# Altium schematic sheet Gecko_IO.SchDoc: Gecko_IO
size A4; Organization: Gateway; Address1: University of Colorado; Address2: Boulder; DocumentNumber: 5; Revision: 1; SheetNumber: 5; SheetTotal: 6
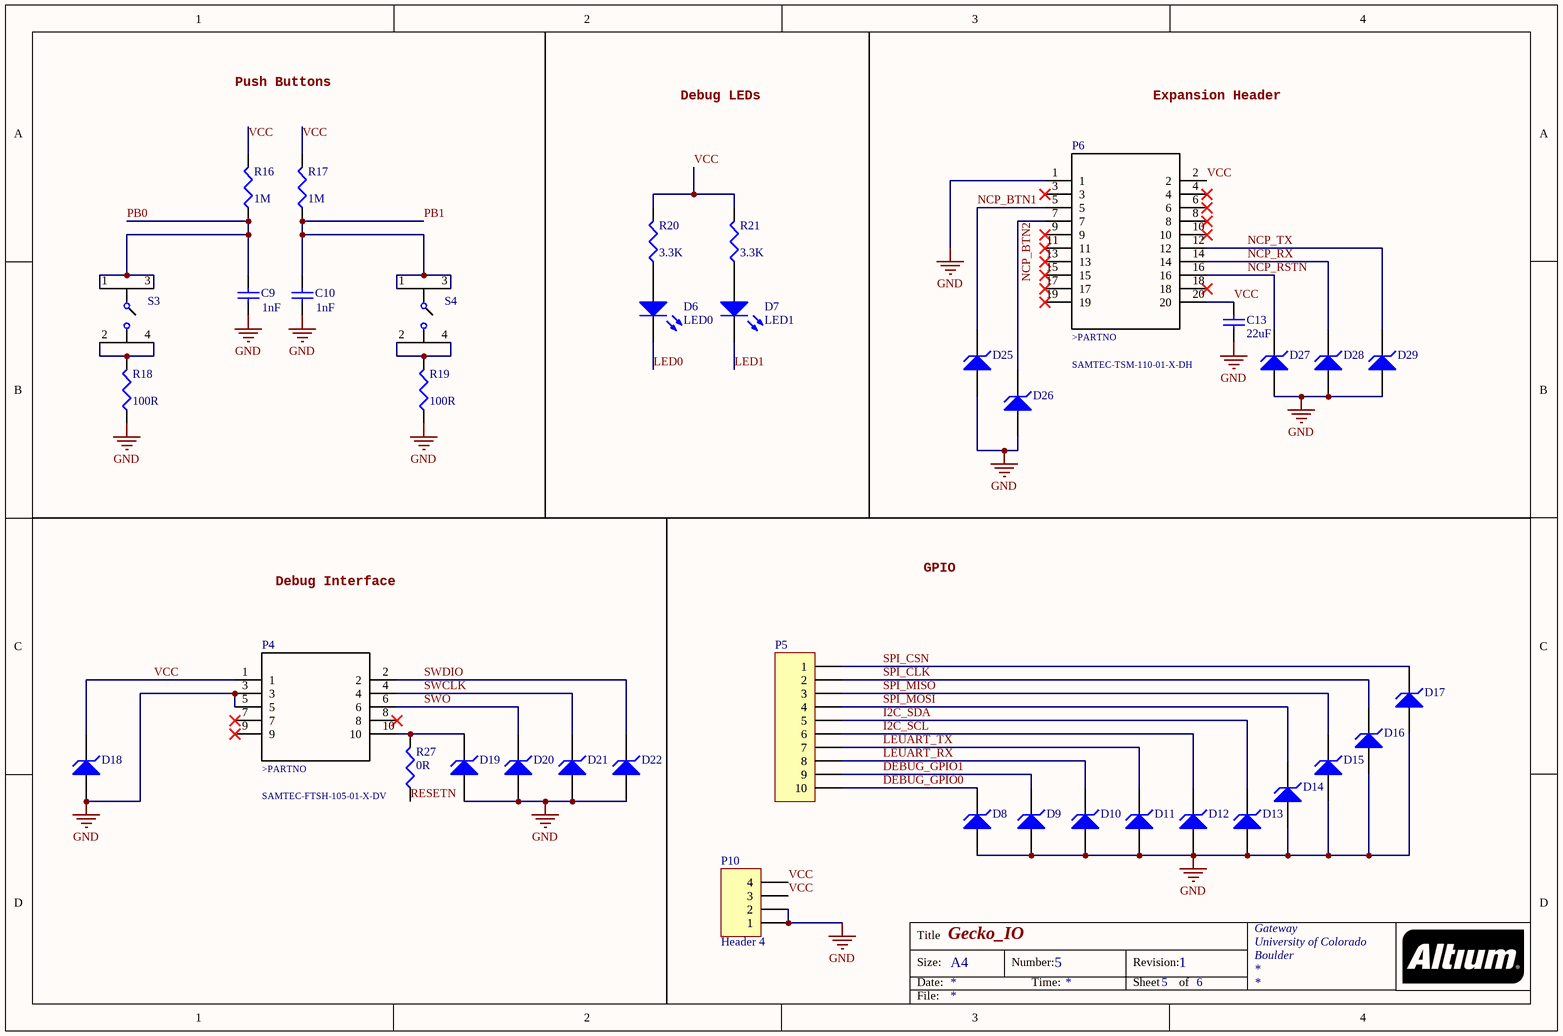
[diagram p0: Gecko_IO.SchDoc]

## Parts
C9  value 1nF  [1608[0603]]  (hidden comment: 06035C102JAT2A)
C10  value 1nF  [1608[0603]]  (hidden comment: 06035C102JAT2A)
C13  value 22uF  [1608[0603]]  (hidden comment: CL10A226MPCNUBE)
D6  LED0  [1608[0603]]
D7  LED1  [1608[0603]]
D8  CZRQR3V3B-HF  [0402]  (value not drawn)
D9  CZRQR3V3B-HF  [0402]  (value not drawn)
D10  CZRQR3V3B-HF  [0402]  (value not drawn)
D11  CZRQR3V3B-HF  [0402]  (value not drawn)
D12  CZRQR3V3B-HF  [0402]  (value not drawn)
D13  CZRQR3V3B-HF  [0402]  (value not drawn)
D14  CZRQR3V3B-HF  [0402]  (value not drawn)
D15  CZRQR3V3B-HF  [0402]  (value not drawn)
D16  CZRQR3V3B-HF  [0402]  (value not drawn)
D17  CZRQR3V3B-HF  [0402]  (value not drawn)
D18  CZRQR3V3B-HF  [0402]  (value not drawn)
D19  CZRQR3V3B-HF  [0402]  (value not drawn)
D20  CZRQR3V3B-HF  [0402]  (value not drawn)
D21  CZRQR3V3B-HF  [0402]  (value not drawn)
D22  CZRQR3V3B-HF  [0402]  (value not drawn)
D25  CZRQR3V3B-HF  [0402]  (value not drawn)
D26  CZRQR3V3B-HF  [0402]  (value not drawn)
D27  CZRQR3V3B-HF  [0402]  (value not drawn)
D28  CZRQR3V3B-HF  [0402]  (value not drawn)
D29  CZRQR3V3B-HF  [0402]  (value not drawn)
P4  PROG_HDR  [SAMTEC-FTSH-105-01-X-DV]  (value not drawn)
P5  (no value)  [HDR1X10]
P6  TSM-110-01-L-DH-A-P-TR  [SAMTEC-TSM-110-01-X-DH]  (value not drawn)
P10  Header 4  [HDR1X4]
R16  value 1M  [1608[0603]]  (hidden comment: RC1608J105CS)
R17  value 1M  [1608[0603]]  (hidden comment: RC1608J105CS)
R18  value 100R  [1608[0603]]  (hidden comment: CRCW0603100RJNEAC)
R19  value 100R  [1608[0603]]  (hidden comment: CRCW0603100RJNEAC)
R20  value 3.3K  [1608[0603]]  (hidden comment: ERJ-3GEYJ332V)
R21  value 3.3K  [1608[0603]]  (hidden comment: ERJ-3GEYJ332V)
R27  value 0R  [C1206]  (hidden comment: MCT0603MZ0000ZP500)
S3  PB0  [430182043816]  (value not drawn)
S4  PB1  [430182043816]  (value not drawn)

## Nets
GND: C9.1 C10.1 C13.2 D8.1(A) D9.1(A) D10.1(A) D11.1(A) D12.1(A) D13.1(A) D14.1(A) D15.1(A) D16.1(A) D17.1(A) D18.1(A) D19.1(A) D20.1(A) D21.1(A) D22.1(A) D25.1(A) D26.1(A) D27.1(A) D28.1(A) D29.1(A) P4.3 P4.5 P6.1 P10.1 P10.2 R18.1 R19.1
DEBUG_GPIO0: D8.2(K) P5.10
DEBUG_GPIO1: D9.2(K) P5.9
I2C_SCL: D12.2(K) P5.6
I2C_SDA: D13.2(K) P5.5
LED0: D6.2(K)
LED1: D7.2(K)
LEUART_RX: D10.2(K) P5.8
LEUART_TX: D11.2(K) P5.7
NCP_BTN1: D25.2(K) P6.5
NCP_BTN2: D26.2(K) P6.7
NCP_RSTN: D27.2(K) P6.16
NCP_RX: D28.2(K) P6.14
NCP_TX: D29.2(K) P6.12
PB0: C9.2 R16.1 S3.1 S3.3
PB1: C10.2 R17.1 S4.1 S4.3
RESETN: R27.1
SPI_CLK: D16.2(K) P5.2
SPI_CSN: D17.2(K) P5.1
SPI_MISO: D15.2(K) P5.3
SPI_MOSI: D14.2(K) P5.4
SWCLK: D21.2(K) P4.4
SWDIO: D22.2(K) P4.2
SWO: D20.2(K) P4.6
VCC: C13.1 D18.2(K) P4.1 P6.2 P6.20 P10.3 P10.4 R16.2 R17.2 R20.2 R21.2
NetD6_1: D6.1(A) R20.1
NetD7_1: D7.1(A) R21.1
NetD19_2: D19.2(K) P4.10 R27.2
NetR18_2: R18.2 S3.2 S3.4
NetR19_2: R19.2 S4.2 S4.4

Not connected (* = marked no-connect by the designer): P4 7* 8* 9*; P6 3* 4* 6* 8* 9* 10* 11* 13* 15* 17* 18* 19*

## Notes on the sheet
- Push Buttons
- Debug LEDs
- Expansion Header
- Debug Interface
- GPIO
- Title
- Size:
- Date:
- A4
- Number:
- Time:
- Revision:
- Sheet
- of
- File:
- (in symbol SAMTEC-FTSH-105-01-X-DV) >PARTNO
- (in symbol SAMTEC-TSM-110-01-X-DH) >PARTNO

## Library data of the parts
C9 C10 = Cap: CAP CER 1000PF 50V X7R 0603; Manufacturer: AVX Corporation; Published: 8-Jun-2000; LatestRevisionDate: 17-Jul-2002; LatestRevisionNote: Re-released for DXP Platform.; PackageReference: RAD-0.3; Publisher: Altium Limited; PackageDescription: Radial Cap, Thru-Hole; 2 Leads; 0.3 in Pin Spacing; Digi-Key Part Number: 478-5006-1-ND; Manufacturer Part Number: 06035C102JAT2A; ComponentLink1Description: Digi-Key Link; ComponentLink1URL: https://www.digikey.com/product-detail/en/avx-corporation/06035C102JAT2A/478-5006-1-ND/1888217
C13 = Cap: CAP CER 22UF 10V X5R 0603; Manufacturer: Samsung Electro-Mechanics; Published: 8-Jun-2000; LatestRevisionDate: 17-Jul-2002; LatestRevisionNote: Re-released for DXP Platform.; PackageReference: RAD-0.3; Publisher: Altium Limited; PackageDescription: Radial Cap, Thru-Hole; 2 Leads; 0.3 in Pin Spacing; Manufacturer Part Number: CL10A226MPCNUBE; Digi-Key Part Number: 1276-6504-1-ND; ComponentLink1URL: https://www.digikey.com/product-detail/en/samsung-electro-mechanics/CL10A226MPCNUBE/1276-6504-1-ND/5961363; ComponentLink1Description: Digi-Key Link
D6 D7 = LED2: LED GREEN DIFFUSED 0603 SMD; Manufacturer: OSRAM Opto Semiconductors Inc.; Manufacturer Part Number: LG L29K-F2J1-24-Z; Digi-Key Part Number: 475-3118-1-ND; ComponentLink1URL: https://www.digikey.com/product-detail/en/osram-opto-semiconductors-inc/LG-L29K-F2J1-24-Z/475-3118-1-ND/4899549; ComponentLink1Description: Digi-Key Link
D8-D22 D25-D29 = D Zener: DIODE ZENER 3.3V 125MW 0402; Manufacturer: Comchip Technology; ComponentLink1Description: Digi-Key Link; Value: *; Manufacturer Part Number: CZRQR3V3B-HF; Digi-Key Part Number: 641-1682-1-ND; ComponentLink1URL: https://www.digikey.com/product-detail/en/comchip-technology/CZRQR3V3B-HF/641-1682-1-ND/5147319
P4 = SAMTEC-FTSH-105-01-X-DV: .050" X .050 TERMINAL STRIP; Manufacturer: Samtec; Manufacturer Part Number: FTSH-105-01-F-DV-K-TR; Value: *; Digi-Key Part Number: SAM13160CT-ND; ComponentLink1URL: https://www.digikey.com/products/en/connectors-interconnects/rectangular-connectors-headers-male-pins/314?k=FTSH-105-01-F-DV-K-TR&k=&pkeyword=FTSH-105-01-F-DV-K-TR&pv7=2&sf=0&quantity=&ColumnSort=0&page=1&pageSize=25; ComponentLink1Description: Digi-Key Link
P5 = Header 10: Header, 10-Pin; LatestRevisionDate: 17-Jul-2002; LatestRevisionNote: Re-released for DXP Platform.; Publisher: Altium Limited
P6 = SAMTEC-TSM-110-01-X-DH: .025 SQ. TERMINAL STRIPS; Manufacturer: Samtec Inc.; Digi-Key Part Number: SAM14883CT-ND; Manufacturer Part Number: TSM-110-01-L-DH-A-P-TR; ComponentLink1URL: https://www.digikey.com/product-detail/en/samtec-inc/TSM-110-01-L-DH-A-P-TR/SAM14883CT-ND/9595175; ComponentLink1Description: Digi-Key Link
P10 = Header 4: Header, 4-Pin; LatestRevisionDate: 17-Jul-2002; LatestRevisionNote: Re-released for DXP Platform.; Publisher: Altium Limited
R16 R17 = Res3: RES SMD 1M OHM 5% 1/10W 0603; Manufacturer: Samsung Electro-Mechanics; Published: 8-Jun-2000; LatestRevisionDate: 29-May-2009; LatestRevisionNote: IPC-7351 Footprint Added.; PackageReference: J1-0603; Publisher: Altium Limited; PackageDescription: Chip Resistor; Digi-Key Part Number: 1276-5134-1-ND; Manufacturer Part Number: RC1608J105CS; ComponentLink1URL: https://www.digikey.com/product-detail/en/samsung-electro-mechanics/RC1608J105CS/1276-5134-1-ND/3968106; ComponentLink1Description: Digi-Key Link
R18 R19 = Res3: RES SMD 100 OHM 5% 1/10W 0603; Manufacturer: Vishay Dale; Published: 8-Jun-2000; LatestRevisionDate: 29-May-2009; LatestRevisionNote: IPC-7351 Footprint Added.; PackageReference: J1-0603; Publisher: Altium Limited; PackageDescription: Chip Resistor; Digi-Key Part Number: 541-4059-1-ND; Manufacturer Part Number: CRCW0603100RJNEAC; ComponentLink1URL: https://www.digikey.com/product-detail/en/vishay-dale/CRCW0603100RJNEAC/541-4059-1-ND/7928742; ComponentLink1Description: Digi-Key Link
R20 R21 = Res3: RES SMD 3.3K OHM 5% 1/10W 0603; Manufacturer: Panasonic Electronic Components; Digi-Key Part Number: P3.3KGCT-ND; ComponentLink1URL: https://www.digikey.com/product-detail/en/panasonic-electronic-components/ERJ-3GEYJ332V/P3.3KGCT-ND/135146; ComponentLink1Description: Digi-Key URL; Manufacturer Part Number: ERJ-3GEYJ332V
R27 = Res3: RES 0 OHM JUMPER 1/8W 0603; Manufacturer: Vishay Beyschlag; Published: 8-Jun-2000; LatestRevisionDate: 29-May-2009; LatestRevisionNote: IPC-7351 Footprint Added.; PackageReference: J1-0603; Publisher: Altium Limited; PackageDescription: Chip Resistor; Digi-Key Part Number: 749-1745-1-ND; Manufacturer Part Number: MCT0603MZ0000ZP500; ComponentLink1URL: https://www.digikey.com/product-detail/en/vishay-beyschlag/MCT0603MZ0000ZP500/749-1745-1-ND/7348053; ComponentLink1Description: Digi-Key Link
S3 S4 = 430182043816: SWITCH TACTILE SPST-NO 0.05A 12V; Manufacturer: Wurth Electronics; Manufacturer Part Number: 430182043816; Value: *; Digi-Key Part Number: 732-7004-1-ND; ComponentLink1URL: https://www.digikey.com/products/en/switches/tactile-switches/197?k=430+182+043+816&k=&pkeyword=430+182+043+816&pv7=2&sf=0&quantity=&ColumnSort=0&page=1&pageSize=25; ComponentLink1Description: Digi-Key Link